# Altium schematic sheet Power_supply_MAX6350CSA.SchDoc
size A
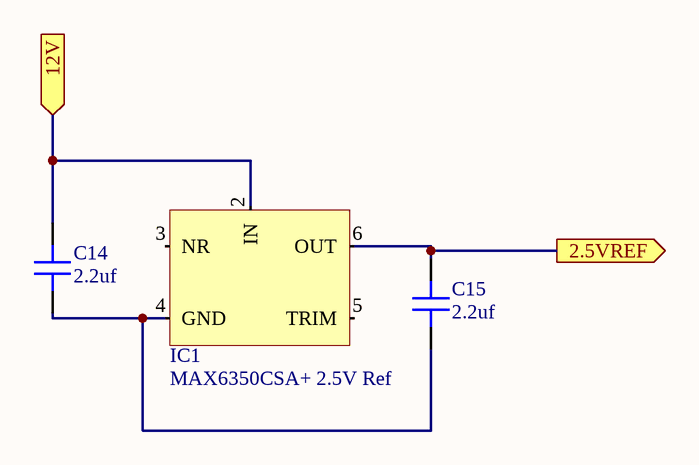
[diagram p0: Power_supply_MAX6350CSA.SchDoc]

## Parts
C14  value 2.2uf  [CAP 0603/1608]  (hidden comment: Capacitor MLCC 2.2uf 16V CAP 0603/1608)
C15  value 2.2uf  [CAP 0603/1608]  (hidden comment: Capacitor MLCC 2.2uf 16V CAP 0603/1608)
IC1  MAX6350CSA+ 2.5V Ref  [SOIC-8]

## Ports
2.5VREF (out), 12V (in)

## Nets
2.5VREF: C15.2 IC1.6(OUT) ; port 2.5VREF
12V: C14.2 IC1.2(IN) ; port 12V
NetC14_1: C14.1 C15.1 IC1.4(GND)

Not connected (* = marked no-connect by the designer): IC1 3(NR) 5(TRIM)

## Library data of the parts
C14 C15 = 231: Manufacturer_id: 1; idCapacitor: 231; Name: Cap_2.2uf_16V_CAP 0603/1608; Dielectric: Ceramic; Created_By: Nick Mah; Drawer_id: 1; Voltage_Rating: 16V; Package: CAP 0603/1608; Created_Date: 10/20/2018
IC1 = 10: IC VREF SERIES 5V 8SOIC; idPMIC_Lin: 10